# Altium project KD_inz_1.PrjPcb
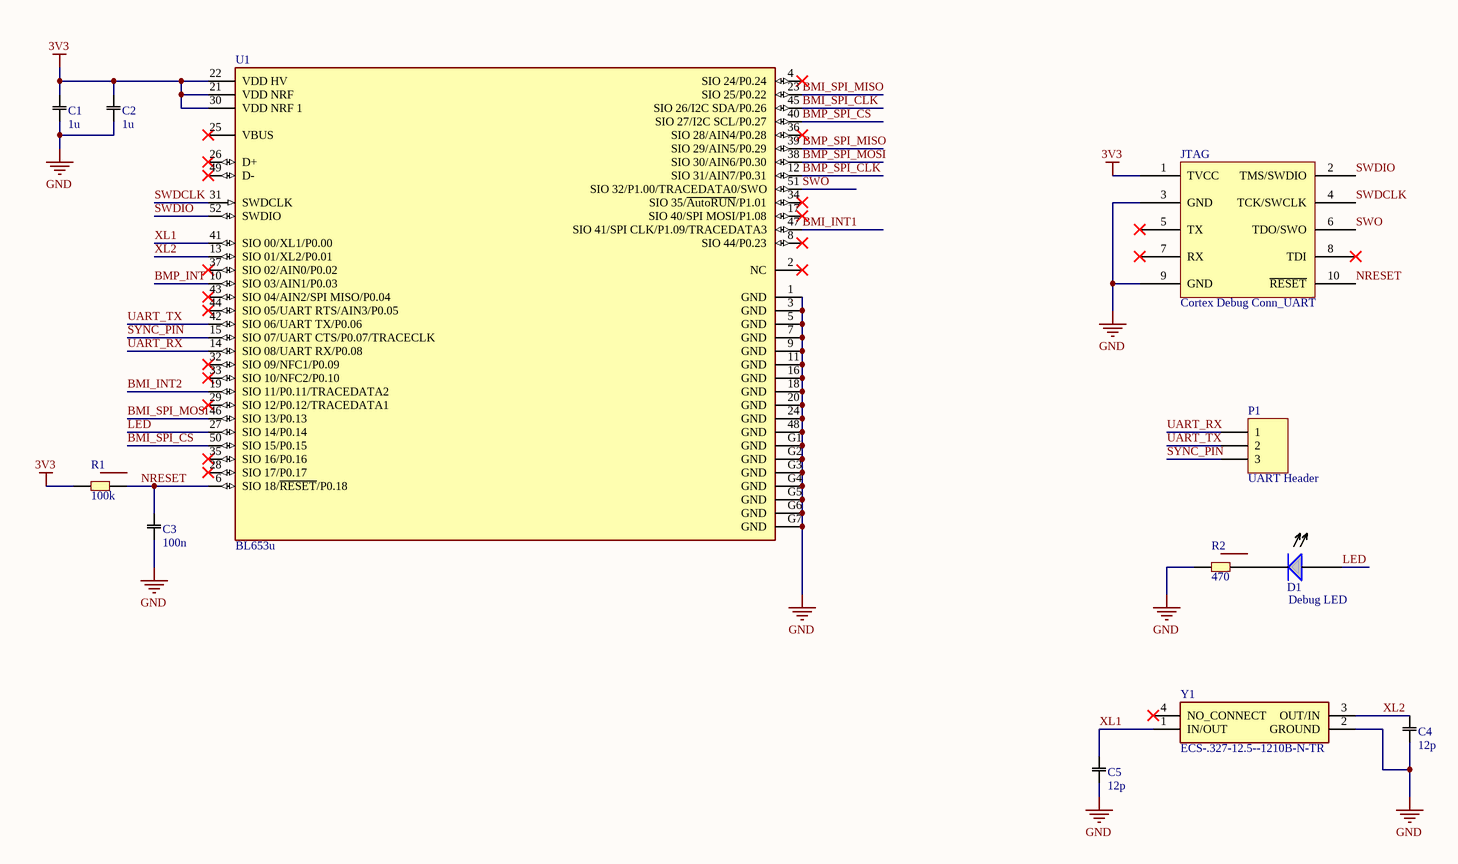
[diagram p0: kd_inz_BL653.SchDoc]
3 sheets, 54 parts. Net scope: global (net labels, ports and power ports of the same name join across sheets).
Board file: kd_inz_pcb.PcbDoc
Sheets:
  kd_inz_BL653.SchDoc
  kd_inz_mems.SchDoc
  kd_inz_supply.SchDoc

## Sheet kd_inz_BL653.SchDoc
size A3; SheetNumber: 1; SheetTotal: 3

### Parts
C1  1u  [0402]
C2  1u  [0402]
C3  100n  [0402]
C4  12p  [0402]
C5  12p  [0402]
D1  Debug LED  [0402]
JTAG  Cortex Debug Conn_UART  [Cortex Debug Connector - THT]
P1  UART Header  [HDR1X3]
R1  100k  [0402]
R2  470  [0402]
U1  BL653u  [FP-453-00059R-MFG]
Y1  ECS-.327-12.5--1210B-N-TR  [ECS3271251210BNTR]

### Nets
3V3: C1.2 C2.2 JTAG.1(TVCC) R1.1 U1.21(VDD_NRF) U1.22(VDD_HV) U1.30(VDD_NRF_1)
GND: C1.1 C2.1 C3.1 C4.1 C5.1 JTAG.3(GND) JTAG.9(GND) R2.1 U1.1(GND) U1.3(GND) U1.5(GND) U1.7(GND) U1.9(GND) U1.11(GND) U1.16(GND) U1.18(GND) U1.20(GND) U1.24(GND) U1.48(GND) U1.G1(GND) U1.G2(GND) U1.G3(GND) U1.G4(GND) U1.G5(GND) U1.G6(GND) U1.G7(GND) Y1.2(GROUND)
BMI_INT1: U1.47(SIO_41/SPI_CLK/P1.09/TRACEDATA3)
BMI_INT2: U1.19(SIO_11/P0.11/TRACEDATA2)
BMI_SPI_CLK: U1.45(SIO_26/I2C_SDA/P0.26)
BMI_SPI_CS: U1.50(SIO_15/P0.15)
BMI_SPI_MISO: U1.23(SIO_25/P0.22)
BMI_SPI_MOSI: U1.46(SIO_13/P0.13)
BMP_INT: U1.10(SIO_03/AIN1/P0.03)
BMP_SPI_CLK: U1.12(SIO_31/AIN7/P0.31)
BMP_SPI_CS: U1.40(SIO_27/I2C_SCL/P0.27)
BMP_SPI_MISO: U1.39(SIO_29/AIN5/P0.29)
BMP_SPI_MOSI: U1.38(SIO_30/AIN6/P0.30)
LED: D1.2 U1.27(SIO_14/P0.14)
NRESET: C3.2 JTAG.10(~{RESET}) R1.2 U1.6(SIO_18/~{RESET}/P0.18)
SWDCLK: JTAG.4(TCK/SWCLK) U1.31(SWDCLK)
SWDIO: JTAG.2(TMS/SWDIO) U1.52(SWDIO)
SWO: JTAG.6(TDO/SWO) U1.51(SIO_32/P1.00/TRACEDATA0/SWO)
SYNC_PIN: P1.3 U1.15(SIO_07/UART_CTS/P0.07/TRACECLK)
UART_RX: P1.1 U1.14(SIO_08/UART_RX/P0.08)
UART_TX: P1.2 U1.42(SIO_06/UART_TX/P0.06)
XL1: C5.2 U1.41(SIO_00/XL1/P0.00) Y1.1(IN/OUT)
XL2: C4.2 U1.13(SIO_01/XL2/P0.01) Y1.3(OUT/IN)
NetD1_1: D1.1 R2.2

Not connected (* = marked no-connect by the designer): JTAG 5(TX)* 7(RX)* 8(TDI)*; U1 2(NC)* 4(SIO_24/P0.24)* 8(SIO_44/P0.23)* 17(SIO_40/SPI_MOSI/P1.08)* 25(VBUS)* 26(D+)* 28(SIO_17/P0.17)* 29(SIO_12/P0.12/TRACEDATA1)* 32(SIO_09/NFC1/P0.09)* 33(SIO_10/NFC2/P0.10)* 34(SIO_35/~{AutoRUN}/P1.01)* 35(SIO_16/P0.16)* 36(SIO_28/AIN4/P0.28)* 37(SIO_02/AIN0/P0.02)* 43(SIO_04/AIN2/SPI_MISO/P0.04)* 44(SIO_05/UART_RTS/AIN3/P0.05)* 49(D-)*; Y1 4(NO_CONNECT)*

### Library data of the parts
C1-C5 = C: Capacitor
D1 = LED
P1 = Header 3: Header, 3-Pin; LatestRevisionDate: 17-Jul-2002; LatestRevisionNote: Re-released for DXP Platform.; Publisher: Altium Limited
R1 R2 = R: Resistor
U1 = BL653u: BL653 MOD INTEGRATED ANT
Y1 = ECS-.327-12.5--1210B-N-TR: Crystal or Oscillator; Manufacturer_Name: ECS; Datasheet Link: https://4donline.ihs.com/images/VipMasterIC/IC/ECSI/ECSI-S-A0011101861/ECSI-S-A0011101861-1.pdf?hkey=EF798316E3902B6ED9A73243A3159BB0; Height: 0.35mm; Manufacturer_Part_Number: ECS-.327-12.5--1210B-N-TR

## Sheet kd_inz_mems.SchDoc
size A3; SheetNumber: 2; SheetTotal: 3
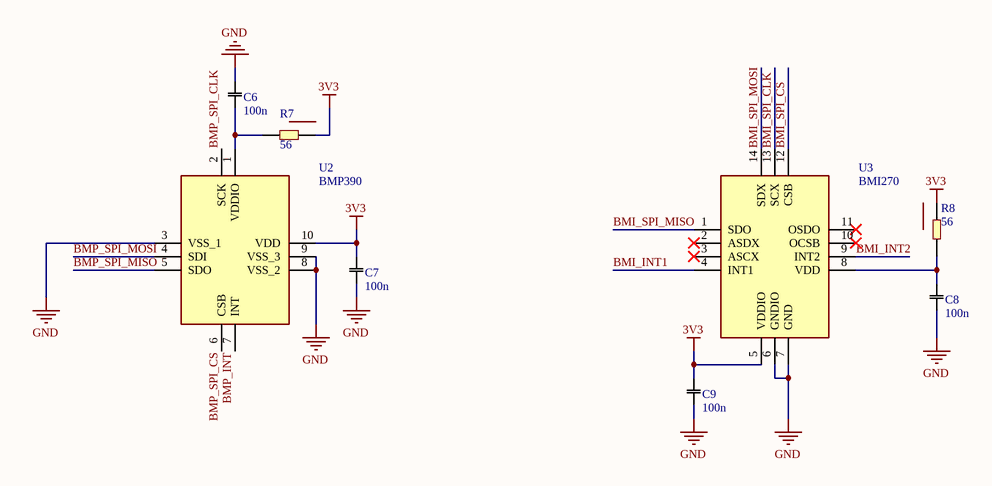
[diagram p1: kd_inz_mems.SchDoc]

### Parts
C6  100n  [0402]
C7  100n  [0402]
C8  100n  [0402]
C9  100n  [0402]
R7  56  [0402]
R8  56  [0402]
U2  BMP390  [BMP390]
U3  BMI270  [QFN50P300X250X87-14N]

### Nets
3V3: C7.2 C9.2 R7.2 R8.2 U2.10(VDD) U3.5(VDDIO)
GND: C6.2 C7.1 C8.1 C9.1 U2.3(VSS_1) U2.8(VSS_2) U2.9(VSS_3) U3.6(GNDIO) U3.7(GND)
BMI_INT1: U3.4(INT1)
BMI_INT2: U3.9(INT2)
BMI_SPI_CLK: U3.13(SCX)
BMI_SPI_CS: U3.12(CSB)
BMI_SPI_MISO: U3.1(SDO)
BMI_SPI_MOSI: U3.14(SDX)
BMP_INT: U2.7(INT)
BMP_SPI_CLK: U2.2(SCK)
BMP_SPI_CS: U2.6(CSB)
BMP_SPI_MISO: U2.5(SDO)
BMP_SPI_MOSI: U2.4(SDI)
NetC6_1: C6.1 R7.1 U2.1(VDDIO)
NetC8_2: C8.2 R8.1 U3.8(VDD)

Not connected (* = marked no-connect by the designer): U3 2(ASDX)* 3(ASCX)* 10(OCSB)* 11(OSDO)*

### Library data of the parts
C6-C9 = C: Capacitor
R7 R8 = R: Resistor
U2 = BMP390: Integrated Circuit; Manufacturer_Name: BOSCH; Datasheet Link: https://www.bosch-sensortec.com/media/boschsensortec/downloads/datasheets/bst-bmp390-ds002.pdf; Height: 0.8mm; Manufacturer_Part_Number: BMP390; Mouser Part Number: 262-BMP390; Mouser Price/Stock: https://www.mouser.co.uk/ProductDetail/Bosch-Sensortec/BMP390?qs=QNEnbhJQKvYQVfvRMgo2YA%3D%3D; Arrow Part Number: BMP390; Arrow Price/Stock: https://www.arrow.com/en/products/bmp390/bosch?region=nac
U3 = BMI270: Integrated Circuit; Manufacturer_Name: BOSCH; Datasheet Link: https://www.mouser.de/datasheet/2/783/BST-BMI270-FL000-1530947.pdf; Height: 0.87mm; Manufacturer_Part_Number: BMI270; Mouser Part Number: 262-BMI270; Mouser Price/Stock: https://www.mouser.co.uk/ProductDetail/Bosch-Sensortec/BMI270?qs=u16ybLDytRYIj%252BjQEee88A%3D%3D; Arrow Part Number: BMI270; Arrow Price/Stock: https://www.arrow.com/en/products/bmi270/bosch?region=nac

## Sheet kd_inz_supply.SchDoc
size A3; SheetNumber: 3; SheetTotal: 3; SPICEModelCacheAOTSFBYF: <root> / <DocumentId>AOTSFBYF</DocumentId> / <CacheFrame Number="0"> / <Model Name="cap" Kind="MDL"> / <Text>*Default semiconductor capacitor / .MODEL CAP C()</Text> / </Model> / </CacheFrame> / </root>
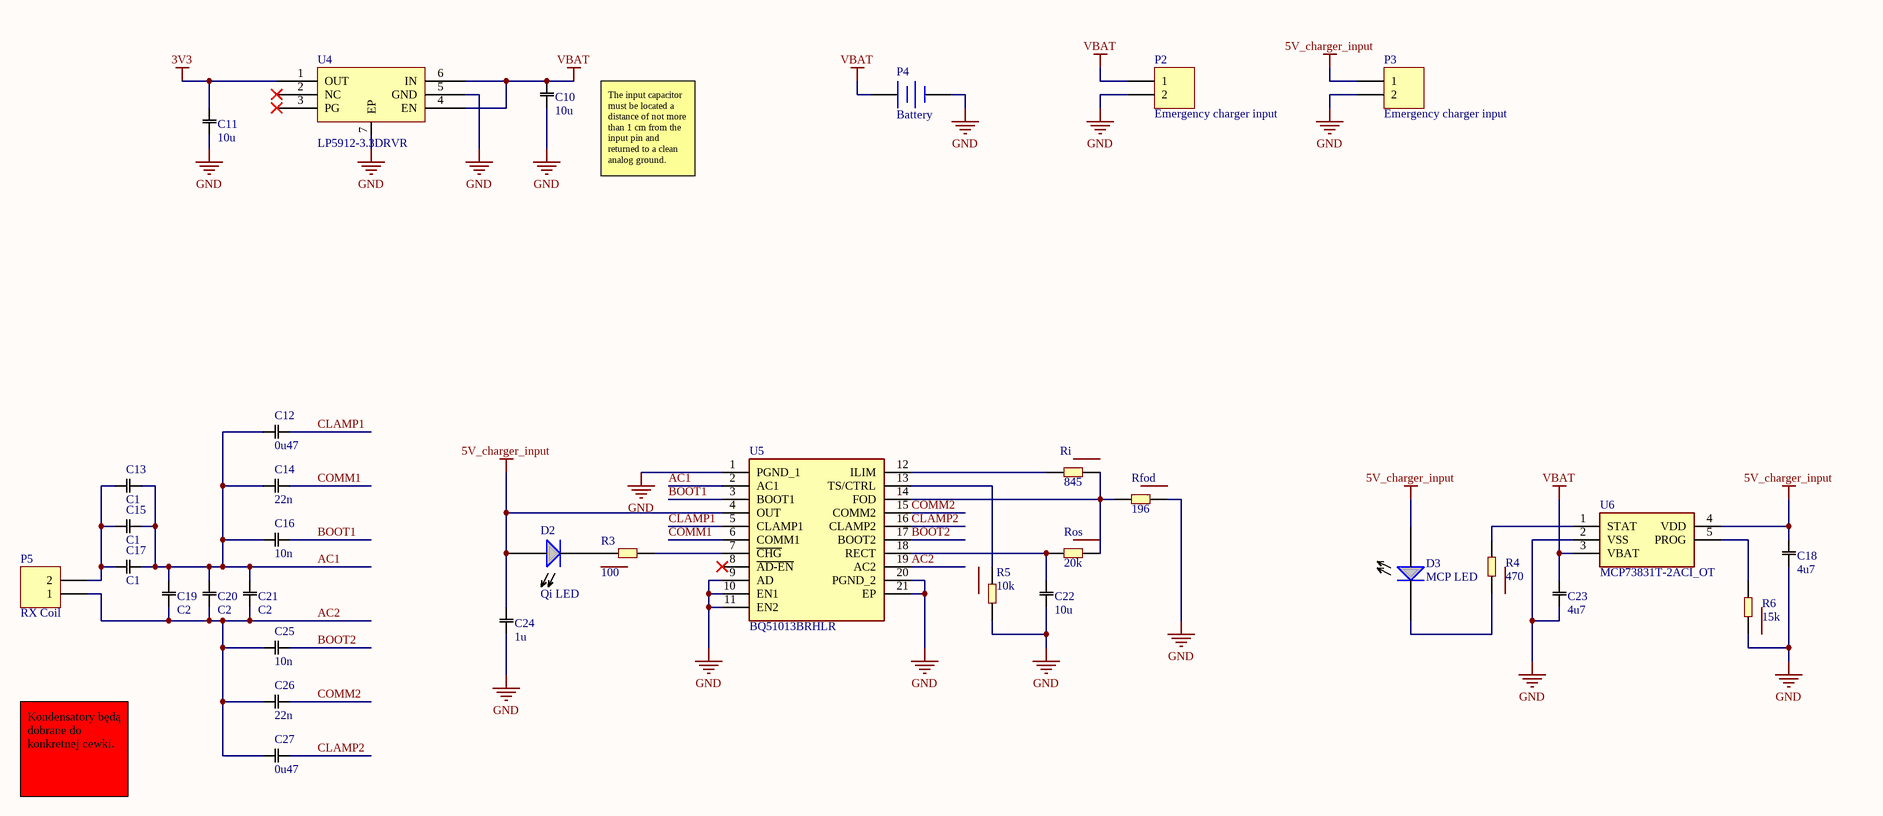
[diagram p2: kd_inz_supply.SchDoc]

### Parts
C10  10u  [0402]
C11  10u  [0402]
C12  0u47  [0402]
C13  C1  [0402]
C14  22n  [0402]
C15  C1  [0402]
C16  10n  [0402]
C17  C1  [0402]
C18  4u7  [0402]
C19  C2  [0402]
C20  C2  [0402]
C21  C2  [0402]
C22  10u  [0402]
C23  4u7  [0402]
C24  1u  [0402]
C25  10n  [0402]
C26  22n  [0402]
C27  0u47  [0402]
D2  Qi LED  [0402]
D3  MCP LED  [0402]
P2  Emergency charger input  [HDR1X2]
P3  Emergency charger input  [HDR1X2]
P4  Battery  [BAT-2]
P5  RX Coil  [HDR1X2]
R3  100  [0402]
R4  470  [0402]
R5  10k  [0402]
R6  15k  [0402]
Rfod  196  [0402]
Ri  845  [0402]
Ros  20k  [0402]
U4  LP5912-3.3DRVR  [WSON-6]
U5  BQ51013BRHLR  [BQ51050BRHLR]
U6  MCP73831T-2ACI_OT  [SOT95P270X145-5N]

### Nets
3V3: C11.2 U4.1(OUT)
5V_charger_input: C18.2 C24.2 D2.2 D3.2 P3.1 U5.4(OUT) U6.4(VDD)
GND: C10.1 C11.1 C18.1 C22.1 C23.1 C24.1 P2.2 P3.2 P4.2(-) R5.1 R6.2 Rfod.2 U4.5(GND) U4.7(EP) U5.1(PGND_1) U5.9(AD) U5.10(EN1) U5.11(EN2) U5.20(PGND_2) U5.21(EP) U6.2(VSS)
VBAT: C10.2 C23.2 P2.1 P4.1(+) U4.4(EN) U4.6(IN) U6.3(VBAT)
AC1: C12.2 C13.2 C14.1 C15.2 C16.1 C17.2 C19.2 C20.2 C21.2 U5.2(AC1)
AC2: C19.1 C20.1 C21.1 C25.1 C26.1 C27.1 P5.1 U5.19(AC2)
BOOT1: C16.2 U5.3(BOOT1)
BOOT2: C25.2 U5.17(BOOT2)
CLAMP1: C12.1 U5.5(CLAMP1)
CLAMP2: C27.2 U5.16(CLAMP2)
COMM1: C14.2 U5.6(COMM1)
COMM2: C26.2 U5.15(COMM2)
NetC13_1: C13.1 C15.1 C17.1 P5.2
NetC22_2: C22.2 Ros.1 U5.18(RECT)
NetD2_1: D2.1 R3.2
NetD3_1: D3.1 R4.2
NetR3_1: R3.1 U5.7(~{CHG})
NetR4_1: R4.1 U6.1(STAT)
NetR5_2: R5.2 U5.13(TS/CTRL)
NetR6_1: R6.1 U6.5(PROG)
NetRfod_1: Rfod.1 Ri.2 Ros.2 U5.14(FOD)
NetRi_1: Ri.1 U5.12(ILIM)

Not connected (* = marked no-connect by the designer): U4 2(NC)* 3(PG)*; U5 8(~{AD-EN})*

### Notes on the sheet
- The input capacitor must be located a distance of not more than 1 cm from the input pin and returned to a clean
  analog ground.
- Kondensatory będą dobrane do konkretnej cewki.

### Library data of the parts
C10-C27 = C: Capacitor
D2 D3 = LED
P2 P3 P5 = Header 2: Header, 2-Pin; LatestRevisionDate: 17-Jul-2002; LatestRevisionNote: Re-released for DXP Platform.; Publisher: Altium Limited
P4 = Battery: Multicell Battery; Published: 24-Mar-1999; LatestRevisionDate: 17-Jul-2002; LatestRevisionNote: Re-released for DXP Platform.; PackageReference: BAT-2; Publisher: Altium Limited; PackageDescription: Battery; 2 Leads
R3-R6 Rfod Ri Ros = R: Resistor
U4 = LP5912
U5 = BQ51013BRHLR: Integrated Circuit; Manufacturer_Name: Texas Instruments; Datasheet Link: http://www.ti.com/lit/ds/symlink/bq51013b.pdf; Manufacturer_Part_Number: BQ51013BRHLR; Mouser Part Number: 595-BQ51013BRHLR; Mouser Price/Stock: https://www.mouser.co.uk/ProductDetail/Texas-Instruments/BQ51013BRHLR?qs=y1vSg4rOnUJlN8ZPg6D5Pw%3D%3D; Arrow Part Number: BQ51013BRHLR; Arrow Price/Stock: https://www.arrow.com/en/products/bq51013brhlr/texas-instruments?region=nac
U6 = MCP73831T-2ACI_OT: Integrated Circuit; Manufacturer_Name: Microchip; Manufacturer_Part_Number: MCP73831T-2ACI/OT; Datasheet Link: http://ww1.microchip.com/downloads/en/DeviceDoc/20001984g.pdf; Height: 1.45mm; Mouser Part Number: 579-MCP73831T-2ACIOT; Mouser Price/Stock: https://www.mouser.co.uk/ProductDetail/Microchip-Technology/MCP73831T-2ACI-OT?qs=yUQqVecv4qvbBQBGbHx0Mw%3D%3D; Arrow Part Number: MCP73831T-2ACI/OT; Arrow Price/Stock: https://www.arrow.com/en/products/mcp73831t-2aciot/microchip-technology?region=nac

## Nets that join several sheets
3V3: kd_inz_BL653 (7 pins), kd_inz_mems (6 pins), kd_inz_supply (C11.2 U4.1)
GND: kd_inz_BL653 (27 pins), kd_inz_mems (9 pins), kd_inz_supply (21 pins)
BMI_INT1: kd_inz_BL653 (U1.47), kd_inz_mems (U3.4)
BMI_INT2: kd_inz_BL653 (U1.19), kd_inz_mems (U3.9)
BMI_SPI_CLK: kd_inz_BL653 (U1.45), kd_inz_mems (U3.13)
BMI_SPI_CS: kd_inz_BL653 (U1.50), kd_inz_mems (U3.12)
BMI_SPI_MISO: kd_inz_BL653 (U1.23), kd_inz_mems (U3.1)
BMI_SPI_MOSI: kd_inz_BL653 (U1.46), kd_inz_mems (U3.14)
BMP_INT: kd_inz_BL653 (U1.10), kd_inz_mems (U2.7)
BMP_SPI_CLK: kd_inz_BL653 (U1.12), kd_inz_mems (U2.2)
BMP_SPI_CS: kd_inz_BL653 (U1.40), kd_inz_mems (U2.6)
BMP_SPI_MISO: kd_inz_BL653 (U1.39), kd_inz_mems (U2.5)
BMP_SPI_MOSI: kd_inz_BL653 (U1.38), kd_inz_mems (U2.4)